# EAGLE design 0.91inch_128x32_oled_i2c_EVM_v1.0 (EAGLE 9.6.0)
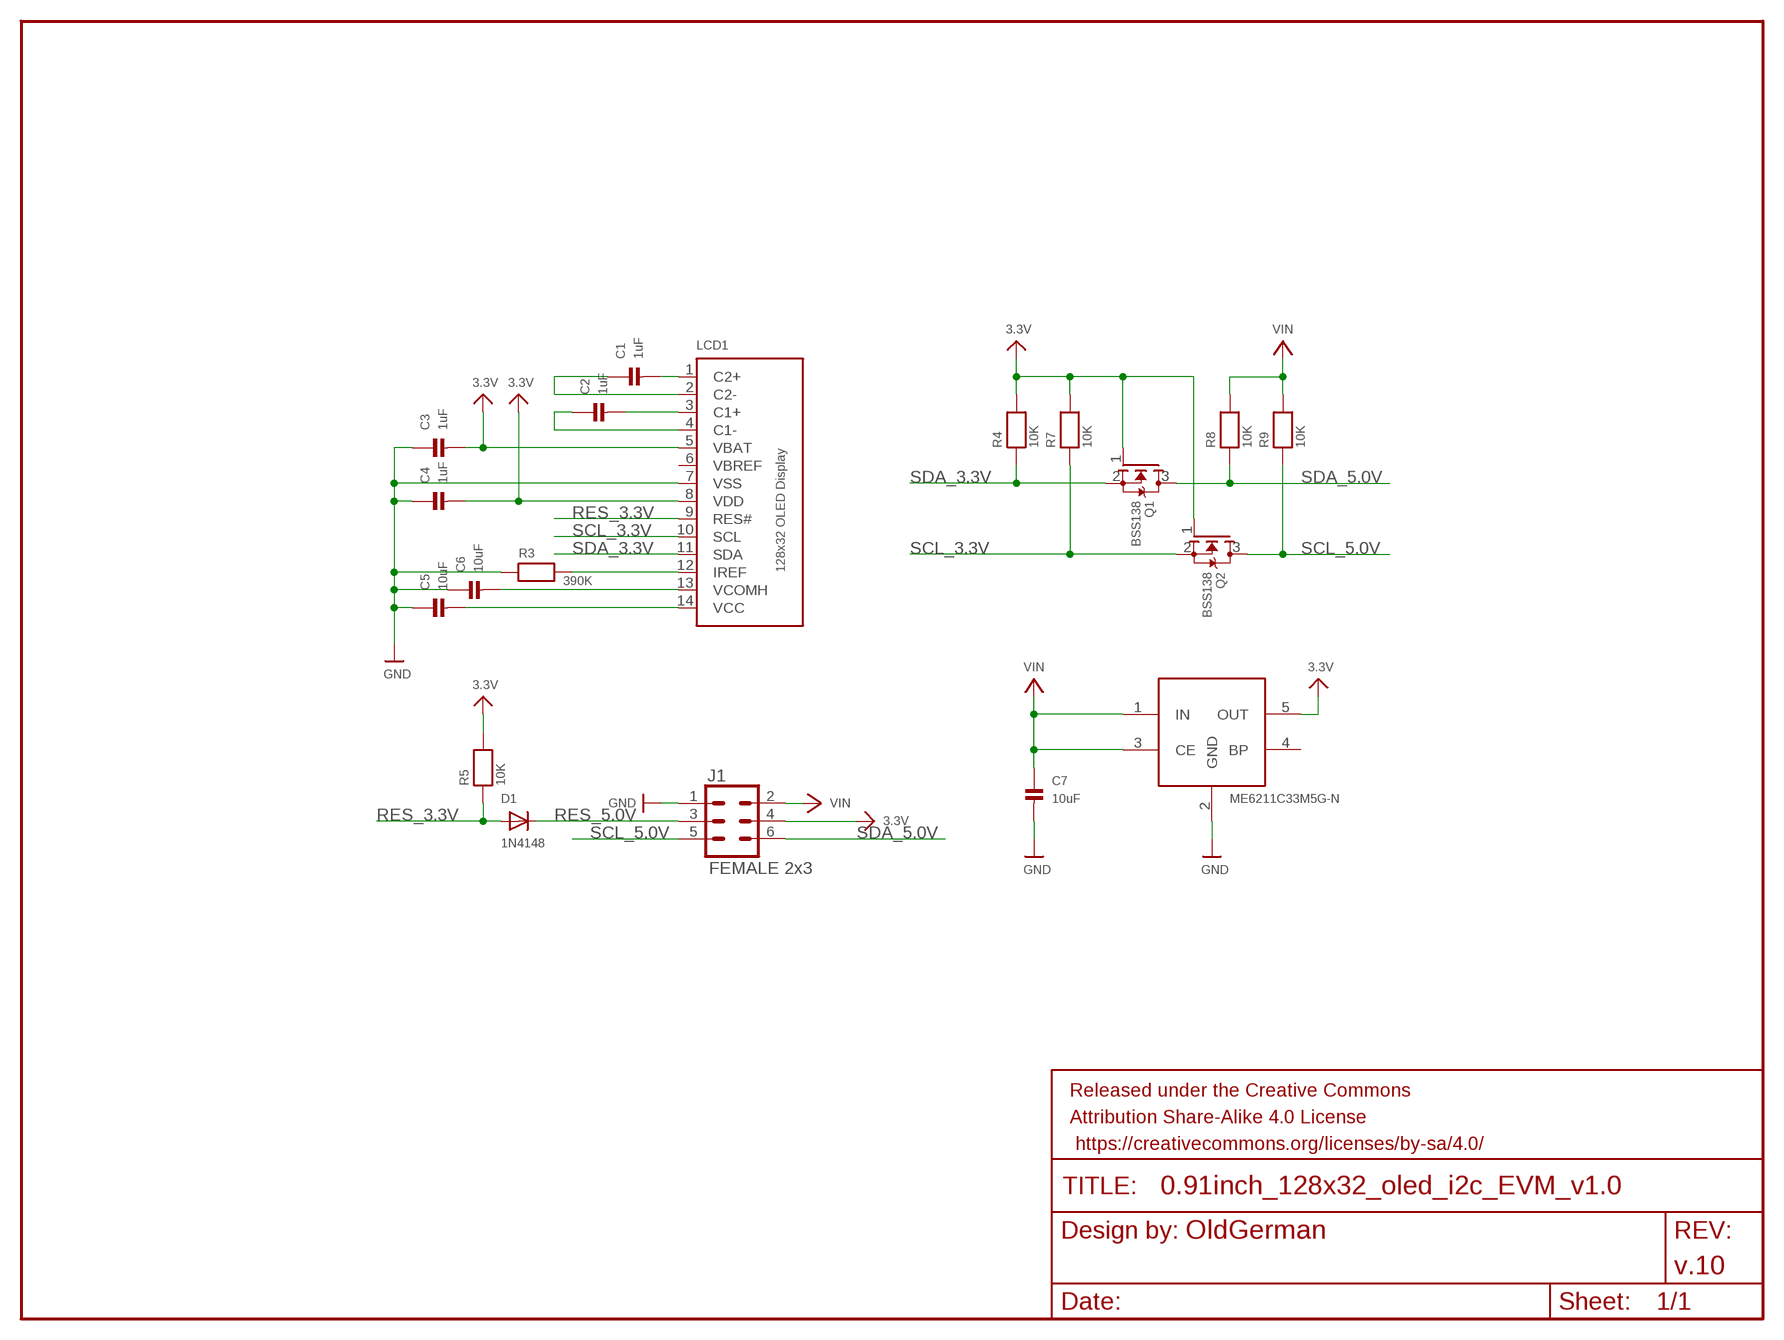
[diagram p0: schematic, sheet 1]

## Parts
C1  1uF  CAP_CERAMIC0603  [0603]
C2  1uF  CAP_CERAMIC0603  [0603]
C3  1uF  CAP_CERAMIC0603  [0603]
C4  1uF  CAP_CERAMIC0603  [0603]
C5  10uF  CAP_CERAMIC0603  [0603]
C6  10uF  CAP_CERAMIC0603  [0603]
C7  10uF  CAP_CERAMIC0603  [0603]
D1  1N4148  DIODESOD-323F  [SOD-323F]
FRAME2  FRAME-LETTER  [CREATIVE_COMMONS]
J1  FEMALE 2x3  CONN_03X2FEMALE  [2X3]
LCD1  0.91INCH_OLED_128X32_CH1115  [0.91INCH_128X32_OLED_CH1115]
Q1  BSS138  MOSFET-NWIDE  [SOT23-WIDE]
Q2  BSS138  MOSFET-NWIDE  [SOT23-WIDE]
R3  390K  RESISTOR0603  [0603]
R4  10K  RESISTOR0603  [0603]
R5  10K  RESISTOR0603  [0603]
R7  10K  RESISTOR0603  [0603]
R8  10K  RESISTOR0603  [0603]
R9  10K  RESISTOR0603  [0603]
U$6  ME6211C33M5G-N  [SOT23-5]

## Nets
3.3V: C3.2 J1.4 LCD1.5(VBAT) Q1.1(G) Q2.1(G) R4.2 R5.2 R7.2 U$6.5(OUT)
GND: C3.1 C4.1 C5.1 C6.1 C7.2 J1.1 LCD1.7(VSS) R3.1 U$6.2(GND)
N$1: C1.2 LCD1.1(C2+)
N$2: C1.1 LCD1.2(C2-)
N$3: C2.2 LCD1.3(C1+)
N$4: C2.1 LCD1.4(C1-)
N$5: C6.2 LCD1.13(VCOMH)
N$6: C5.2 LCD1.14(VCC)
N$7: LCD1.12(IREF) R3.2
N$8: C4.2 LCD1.8(VDD) ; supply symbol labelled 3.3V
RES_3.3V: D1.A LCD1.9(RES#) R5.1
RES_5.0V: D1.C J1.3
SCL_3.3V: LCD1.10(SCL) Q2.2(S) R7.1
SCL_5.0V: J1.5 Q2.3(D) R9.1
SDA_3.3V: LCD1.11(SDA) Q1.2(S) R4.1
SDA_5.0V: J1.6 Q1.3(D) R8.1
VIN: C7.1 J1.2 R8.2 R9.2 U$6.1(IN) U$6.3(CE)
Unconnected: U$6.4(BP)

## Notes on the sheet
- OldGerman
- v.10

## Power pins joined to a net without a drawn wire
VBREF: LCD1.6(VBREF)

## Library data of the parts
C1-C7 = microbuilder:CAP_CERAMIC: Ceramic Capacitors 0402 - 0402 Surface Mount Capacitors 16pF 50V 5% [Digikey: 445-4899-2-ND] 18pF 50V 5% [Digikey: 490-1281-2-ND] 22pF 50V 5% [Digikey: 490-1283-2-ND] 68pF 50V 5% [Digikey: 490-1289-2-ND] 0.1uF 10V 10% [Digikey: 490-1318-2-ND] 1.0uF 6.3V 10% [Digikey: 490-1320-2-ND] 0603 - 0603 Surface Mount Capacitors 16 pF 50V 5% [Digikey: 445-5051-2-ND] 22 pF 50V [Digikey: PCC220ACVTR-ND] 33 pF 50V 5% [Digikey: 490-1415-1-ND] 56pF 50V 5% [Digikey: 490-1421-1-ND] 220pF 50V 5% [Digikey: 445-1285-1-ND] 680 pF 50V 2200 pF 50V 5% C0G [Digikey: 445-1297-1-ND] 5600 pF 100V 5% X7R [Digikey: 478-3711-1-ND] 0.1 µF 25V 10% [Digikey: PCC2277TR-ND] 0.22 µF 16V 10% X7R [Digikey: 445-1318-1-ND] 1.0 µF 25V 10% [Digikey: 445-5146-2-ND] 0603 - RF Specific 3pF 250V +/-0.1pF RF [Digikey: 712-1347-1-ND] 18 pF 250V 5% [Digikey: 478-3505-1-ND or 712-1322-1-ND] 56 pF 250V 5% C0G RF [Digikey: 490-4867-1-ND] 68 pF 250V RF [Digikey: 490-4868-1-ND] 0805 - 0805 Surface Mount Capacitors 220 pF 250V 2% RF Ceramic Capacitor [Digikey: 712-1398-1-ND] 1000 pF 50V 2% NP0 Ceramic Capacitor [Digikey: 478-3760-1-ND] 0.1 µF 25V 10% Ceramic Capacitor [Digikey: PCC1828TR-ND] 1.0 µF 16V 10% Ceramic Capacitor[Digikey: 490-1691-2-ND] 10.0 µF 10V 10% Ceramic Capacitor[Digikey: 709-1228-1-ND] 10.0 uF 16V 10% Ceramic Capacitor [Digikey: 478-5165-2-ND] 47 uF 6.3V 20% Ceramic Capacitor [Digikey: 587-1779-1-ND or 399-5506-1-ND] 1206 - 1206 Surface Mount Capacitors 47uF 10V 20% Ceramic Capacitor [Digikey: 490-5528-1-ND or 399-5508-1-ND or 445-6010-1-ND] 100uF 6.3V -20%, +80% Y5V Ceramic Capacitor (Digikey: 490-4512-1-ND, Mouser: 81-GRM31CF50J107ZE1L)
D1 = adafruit:DIODE: Diode SMADIODE - SMA Surface Mount Package 20V 1A Schottky Diode Digikey: 641-1014-6-ND DO-1N4148 - Through Hole Small Current Diode SOD-123 20V 1 A (.5mV Vf) Schottky Diode - Digikey: MBRX120TPMSCT-ND SOD-323 10V 570mA (.38mV Vf, 3ns) Schottky Diode - Digikey: ZLLS410CT-ND SOD-523 30V 30mA Schottky Diode (RB751S-40TE61) - Digikey: RB751S-40TE61CT-ND SOT23-R/W - SOT23 Package (R = Solder Paste/Reflow Ovens, W = Hand-Soldering) BAT54Film 40V 300mA - Digikey: 497-7162-1-ND
FRAME2 = SparkFun-Aesthetics:FRAME-LETTER: Schematic Frame - Letter Standard 8.5x11 US Letter frame
J1 = SparkFun-Connectors:CONN_03X2: Multi connection point. Often used as Generic Header-pin footprint for 0.1 inch spaced/style header connections You can populate with any combo of single row headers, but if you'd like an exact match, check these: Header - 2x3 (Male, 0.1") <https://www.sparkfun.com/products/12807> (PRT-12807) Header - 2x3 (Female, 0.1") <https://www.sparkfun.com/products/13010> (PRT-13010) 2x3 Pin Shrouded Header <https://www.sparkfun.com/products/10877> (PRT-10877) On any of the 0.1 inch spaced packages, you can populate with these: Break Away Headers - Straight <https://www.sparkfun.com/products/116> (PRT-00116) Break Away Male Headers - Right Angle <https://www.sparkfun.com/products/553> (PRT-00553) Female Headers <https://www.sparkfun.com/products/115> (PRT-00115) Break Away Headers - Machine Pin <https://www.sparkfun.com/products/117> (PRT-00117) Break Away Female Headers - Swiss Machine Pin <https://www.sparkfun.com/products/743> (PRT-00743) Special note: the shrouded connector mates well with our 3x2 ribbon cables: Ribbon Crimp Connector - 6-pin (2x3, Female) <https://www.sparkfun.com/products/10651> (PRT-10651) Ribbon Cable - 6 wire (15ft) <https://www.sparkfun.com/products/10646> (PRT-10646); PROD_ID: CONN-11566
LCD1 = FUSB302:0.91INCH_OLED_128X32_CH1115: 128x32 I2C 0.91" Monochrome OLED Display
Q1 Q2 = microbuilder:MOSFET-N: N-Channel Mosfet LEGEND VDS: Voltage Drain-Source ID: Drain Current RDS(ON): Drain-Source On-State Resistance VGS(TH): Gate-Source Threshold Voltage CISS: Drain-Source Input Capacitance SOT-23 Name VDS ID RDS(ON) VGS(TH) CISS Order Number 2N7002E 60V 260mA 2.5 Ohm 2.5V @ 250uA 26.7pF @ 25V 2N7002ET1GOSTR-ND BSH103 30V 850mA 400 mOhm 400mV @ 1mA 83pF @ 24V BSH103,235-ND BSS138 60V 320mA 1.6 Ohm 1.5V @ 250uA 50pF @ 10V Mouser: 771-BSS138PW115 * BSS138 good choice for I2C level-shifting
R3-R5 R7-R9 = microbuilder:RESISTOR: Resistors 0402 - 0402 Surface Mount Package 22 Ohm 1% 1/16W [Digikey: 311-22.0LRTR-ND] 33 Ohm 5% 1/16W 1.0K 5% 1/16W 1.5K 5% 1/16W 2.0K 1% 1/16W 10.0K 1% 1/16W [Digikey: 311-10.0KLRTR-ND] 10.0K 5% 1/16W [Digikey: RMCF0402JT10K0TR-ND] 12.1K 1% 1/16W [Digikey: 311-22.0LRTR-ND] 100.0K 5% 1/16W 0603 - 0603 Surface Mount Package 0 Ohm 1/10 Watt 1% Resistor 15 Ohm 1/10 Watt 1% Resistor 33 Ohm 1/10 Watt 1% Resistor 49.9 Ohm 1/10 Watt 1% Resistor 100 Ohm 1/10 Watt 1% Resistor 150 Ohm 1/10 Watt 1% Resistor 240 Ohm 1/10 Watt 1% Resistor 390 Ohm 1/10 Watt 1% Resistor 560 Ohm 1/10 Watt 1% Resistor 680 Ohm 1/10 Watt 1% Resistor 750 Ohm 1/10 Watt 1% Resistor 1.0K Ohm 1/10 Watt 1% Resistor 1.5K Ohm 1/10 Watt 1% Resistor 2.0K Ohm 1/10 Watt 1% Resistor 2.2K Ohm 1/10 Watt 1% Resistor 3.3K Ohm 1/10 Watt 1% Resistor 4.7K Ohm 1/10 Watt 1% Resistor 10.0K Ohm 1/10 Watt 1% Resistor 12.0K Ohm 1/10 Watt 1% Resistor 12.1K Ohm 1/10 Watt 1% Resistor 20.0K Ohm 1/10 Watt 1% Resistor 33.0K Ohm 1/10 Watt 1% Resistor 100.0K Ohm 1/10 Watt 1% Resistor 0805 - 0805 Surface Mount Package 0 Ohm 1/8 Watt 1% Resistor 33 Ohm 1/8 Watt 1% Resistor 100 Ohm 1/8 Watt 1% Resistor 150 Ohm 1/8 Watt 1% Resistor 200 Ohm 1/8 Watt 1% Resistor 240 Ohm 1/8 Watt 1% Resistor 330 Ohm 1/8 Watt 1% Resistor 390 Ohm 1/8 Watt 1% Resistor 470 Ohm 1/8 Watt 1% Resistor 1.0K Ohm 1/8 Watt 1% Resistor 1.5K Ohm 1/8 Watt 1% Resistor 2.0K Ohm 1/8 Watt 1% Resistor 4.7K Ohm 1/8 Watt 1% Resistor 5.1K Ohm 1/8 Watt 1% Resistor 5.6K Ohm 1/8 Watt 1% Resistor 10.0K Ohm 1/8 Watt 1% Resistor 22.0K Ohm 1/8 Watt 1% Resistor 33.0K Ohm 1/8 Watt 1% Resistor 100K Ohm 1/8 Watt 1% Resistor 1206 - 1206 Surface Mount Package 2012 - 2010 Surface Mount Package 0.11 Ohm 1/2 Watt 1% Resistor - Digikey: RHM.11UCT-ND
U$6 = SparkFun-IC-Power:ME6211C33M5G-N: ME621133M5G-N SOT23-5 3.3V 500mA 低差压线性稳压器

## Board
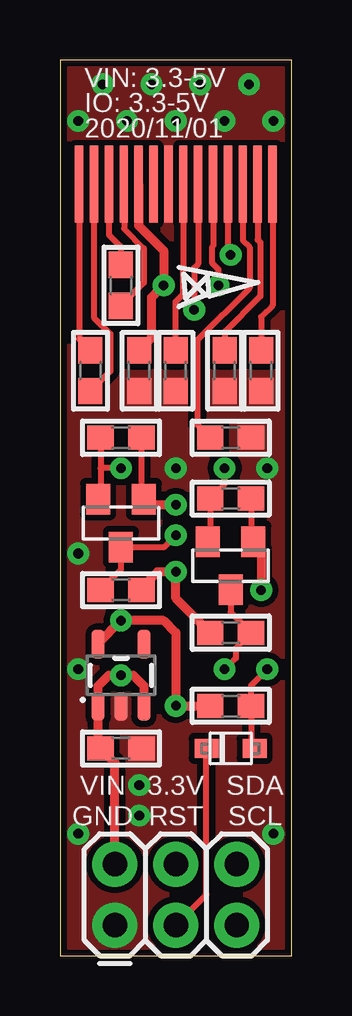
[diagram p1: board, top side]
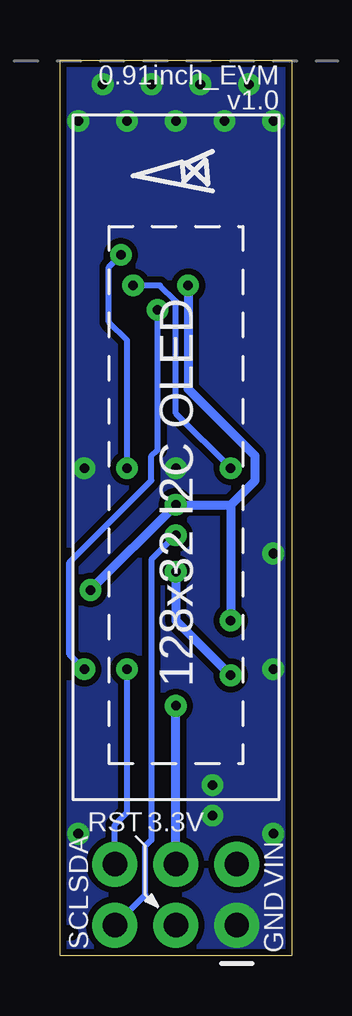
[diagram p2: board, bottom side, seen from below]

Size 9.65 x 37.34 mm. Coordinates in mm from the lower left corner, seen from the top.
Outline: 9.65,37.34 0,37.34 0,0 9.65,0 9.65,37.34
Copper layers (1*16): Top 0.035mm / dielectric 1.5mm / Bottom 0.035mm
Design rules "default *": minimum track width 8mil, minimum drill 0.4mm, track to track 6mil, track to pad 6mil, pad to pad 6mil, via to via 6mil, smd to smd 6mil, copper to edge 10mil, drill to drill 8mil, minimum pad ring 8mil, minimum via ring 10mil, stop-mask expansion 3mil, vias tented up to drill 20mil, thermal gap 8mil
bRestrict: area 9,-1.1 to 9.7,-1; area 9.1,0.9 to 9.7,1

### Footprints (pad centres in the part's own frame; a part is rotated, then mirrored left to right if it is on the bottom)
0603 = smd 1.1 x 1: 1 -0.85,0; 2 0.85,0
SOD-323F = smd 1 x 0.8: A -1,0; C 1,0
2X3 = drill 1.016 pad 1.88: 1 0,0; 2 0,2.54; 3 2.54,0; 4 2.54,2.54; 5 5.08,0; 6 5.08,2.54
0.91INCH_128X32_OLED_CH1115 = smd 3.2 x 0.35 bottom: 1 -2.888,-4.03; 2 -2.888,-3.41; 3 -2.888,-2.79; 4 -2.888,-2.17; 5 -2.888,-1.55; 6 -2.888,-0.93; 7 -2.888,-0.31; 8 -2.888,0.31; 9 -2.888,0.93; 10 -2.888,1.55; 11 -2.888,2.17; 12 -2.888,2.79; 13 -2.888,3.41; 14 -2.888,4.03
SOT23-WIDE = smd 1 x 1.27: 1 -0.95,-1; 2 0.95,-1; 3 0,1
SOT23-5 = smd 0.55 x 1.2: 1 -0.95,-1.3; 2 0,-1.3; 3 0.95,-1.3; 4 0.95,1.3; 5 -0.95,1.3

### Placement (x,y rotation side)
C1  1.27,24.38 90 top
C2  2.54,27.94 90 top
C3  3.3,24.38 90 top
C4  4.83,24.38 90 top
C5  8.38,24.38 90 top
C6  6.86,24.38 90 top
C7  2.54,8.64 0 top
D1  7.11,8.64 180 top
FRAME2  -26.92,-11.43 0 top  (outside the outline)
J1  2.29,1.27 0 top
LCD1  4.83,35.05 90 bottom
Q1  7.11,16.26 180 top
Q2  2.54,18.03 180 top
R3  7.11,21.59 180 top
R4  7.11,19.05 0 top
R5  7.11,10.41 180 top
R7  2.54,21.59 0 top
R8  7.11,13.46 180 top
R9  2.54,15.24 0 top
U$6  2.54,11.68 0 top

### Tracks (layer width: path | path; a pad name or v marks a point on that pad's centre or on a via)
3.3V  (via drill 0.4)
  Top 0.254: R7.2 3.39,19.13 Q2.1 | R4.2 7.96,17.36 Q1.1
  Top 0.381: LCD1.5 3.28,30.43 4.32,29.39 v4.32,27.94 3.81,27.43 3.81,25.74 C3.2 | U$6.5 1.59,13.02 v2.54,13.97 4.32,13.97 4.83,13.46 v4.83,10.41 R5.2 | Q2.1 3.73,18.8 v4.83,18.8 | Q1.1 8.38,16.94 v8.38,15.24
  Bottom 0.381: v4.32,27.94 4.32,23.62 1.52,20.83 1.52,19.81 2.54,18.8 | 2.54,18.8 v2.54,13.97 | 2.54,18.8 v4.83,18.8 v8.38,15.24 | J1.4 v4.83,10.41
GND  (via drill 0.4)
  other vias: 8.64,20.32 4.83,20.32 4.83,34.8 5.84,36.32 3.81,36.32 6.86,34.8 7.87,36.32 8.89,34.8 2.79,34.8 0.76,34.8 1.78,36.32 0.76,16.76 8.89,5.08 3.3,7.11 0.76,5.08 3.3,5.84 0.76,11.94
  pour Bottom (isolate 0.254, no thermals): -0.51,-1.52 10.59,-1.52 10.59,38.32 -0.51,38.32
  pour Top (isolate 0.254, no thermals): -0.51,-1.52 10.59,-1.52 10.59,38.32 -0.51,38.32
N$1
  Top 0.254: LCD1.1 0.8,25.71 C1.2
N$2
  Top 0.254: LCD1.2 1.42,26.61 2.1,25.92 2.1,24.36 C1.1
N$3
  Top 0.254: LCD1.3 2.04,30.06 2.54,29.55 C2.2
N$4
  Top 0.254: LCD1.4 2.67,32.15 2.67,30.31 3.5,29.48 3.5,28.05 C2.1
N$5
  Top 0.254: LCD1.13 8.24,29.84 8.35,29.72 8.35,27.49 6.86,26 C6.2
N$6
  Top 0.254: LCD1.14 8.86,27.11 8.38,26.63 C5.2
N$7
  Top 0.254: LCD1.12 7.62,29.82 7.9,29.54 7.9,27.84 5.71,25.65 5.71,22.14 R3.2
N$8
  Top 0.254: C4.2 4.8,25.26 4.8,27.25 5.11,27.55 5.11,28.71 5.14,28.74 LCD1.8
RES_3.3V  (via drill 0.4)
  Top 0.254: LCD1.9 5.76,28.84 5.59,28.67 v5.59,26.92 | D1.A 7.96,8.79 R5.1 7.96,11.26 v8.64,11.94
  Bottom 0.254: v8.64,11.94 9.26,12.56 9.26,16.4 5.84,19.81 5.84,20.83 5.59,21.08 v5.59,26.92
RES_5.0V
  Top 0.254: D1.C 6.1,8.62 6.1,2.54 J1.3
SCL_3.3V  (via drill 0.4)
  Top 0.254: LCD1.10 6.38,29.58 6.33,29.54 6.33,28.89 6.6,28.61 v6.6,27.94 | Q2.2 1.69,19.13 R7.1 1.69,20.32 v2.54,20.32
  Bottom 0.254: v2.54,20.32 4.83,22.61 4.83,27.28 5.49,27.94 v6.6,27.94
SCL_5.0V  (via drill 0.4)
  Top 0.254: R9.1 2.54,16.09 Q2.3 2.56,17.02 4.32,17.02 v4.83,17.53
  Bottom 0.254: v4.83,17.53 5.84,16.51 5.84,4.83 6.1,4.57 6.1,2.54 J1.5
SDA_3.3V  (via drill 0.4)
  Top 0.254: LCD1.11 7,29.33 v7.11,29.21 | Q1.2 6.26,17.36 R4.1 6.86,19.65 v6.86,20.32
  Bottom 0.254: v7.11,29.21 7.62,28.7 7.62,26.42 6.86,25.65 v6.86,20.32
SDA_5.0V  (via drill 0.4)
  Top 0.254: Q1.3 7.11,14.31 R8.1 7.33,12.83 7.33,12.41 v6.86,11.94
  Bottom 0.254: J1.6 7.37,5.46 6.86,5.97 v6.86,11.94
VIN  (via drill 0.4)
  Top 0.381: J1.2 2.29,8.04 C7.1 1.59,8.74 U$6.1 1.59,11.24 2.03,11.68 v2.54,11.68 3.05,11.68 3.49,11.24 U$6.3 | R8.2 4.83,14.9 v4.83,16 4.06,16 3.39,15.33 R9.2
  Bottom 0.381: v4.83,16 4.83,13.97 v2.54,11.68

### Text on the board
tPlace: VIN: 3.3-5V / IO: 3.3-5V / 2020/11/01 | VIN | 3.3V | SDA | GND | RST | SCL
bPlace: 0.91inch_EVM / v1.0 | 128x32 I2C OLED | 3.3V | RST | VIN | SDA | GND | SCL
tDocu: OldGerman(过气德国佬)